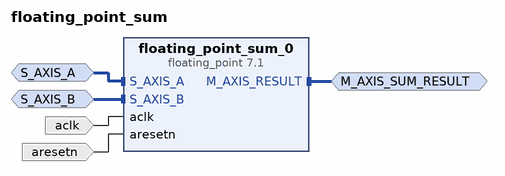
[diagram p0: block diagram of the top level]
# Vivado block design floating_point_sum, xcvu9p-flgb2104-2-i, Vivado 2017.4
create_bd_design floating_point_sum

create_bd_intf_port -mode Master -vlnv xilinx.com:interface:axis_rtl:1.0 M_AXIS_SUM_RESULT
set_property -dict {CONFIG.FREQ_HZ 10000000} [get_bd_intf_ports M_AXIS_SUM_RESULT]
create_bd_intf_port -mode Slave -vlnv xilinx.com:interface:axis_rtl:1.0 S_AXIS_A
set_property -dict [list \
  CONFIG.TDATA_NUM_BYTES 4 \
  CONFIG.TDEST_WIDTH 0 \
  CONFIG.TID_WIDTH 0 \
  CONFIG.TUSER_WIDTH 8 \
  CONFIG.HAS_TREADY 1 \
  CONFIG.HAS_TSTRB 0 \
  CONFIG.HAS_TKEEP 0 \
  CONFIG.HAS_TLAST 0 \
  CONFIG.FREQ_HZ 10000000 \
  CONFIG.LAYERED_METADATA undef \
] [get_bd_intf_ports S_AXIS_A]
create_bd_intf_port -mode Slave -vlnv xilinx.com:interface:axis_rtl:1.0 S_AXIS_B
set_property -dict [list \
  CONFIG.TDATA_NUM_BYTES 4 \
  CONFIG.TDEST_WIDTH 0 \
  CONFIG.TID_WIDTH 0 \
  CONFIG.TUSER_WIDTH 0 \
  CONFIG.HAS_TREADY 1 \
  CONFIG.HAS_TSTRB 0 \
  CONFIG.HAS_TKEEP 0 \
  CONFIG.HAS_TLAST 0 \
  CONFIG.FREQ_HZ 10000000 \
  CONFIG.LAYERED_METADATA undef \
] [get_bd_intf_ports S_AXIS_B]
create_bd_port -dir I -type clk aclk
set_property -dict {CONFIG.FREQ_HZ 10000000} [get_bd_ports aclk]
create_bd_port -dir I -type rst aresetn

create_bd_cell -type ip -vlnv xilinx.com:ip:floating_point:7.1 floating_point_sum_0
set_property -dict [list \
  CONFIG.Add_Sub_Value Add \
  CONFIG.C_Optimization Speed_Optimized \
  CONFIG.C_Mult_Usage Medium_Usage \
  CONFIG.C_Latency 12 \
  CONFIG.C_Rate 1 \
  CONFIG.Has_ARESETn true \
  CONFIG.Has_A_TUSER true \
  CONFIG.A_TUSER_Width 8 \
] [get_bd_cells floating_point_sum_0]

# ---- connections ----

connect_bd_intf_net [get_bd_intf_ports M_AXIS_SUM_RESULT] [get_bd_intf_pins floating_point_sum_0/M_AXIS_RESULT]
connect_bd_intf_net -intf_net S_AXIS_A_0_1 [get_bd_intf_ports S_AXIS_A] [get_bd_intf_pins floating_point_sum_0/S_AXIS_A]
connect_bd_intf_net -intf_net S_AXIS_B_0_1 [get_bd_intf_ports S_AXIS_B] [get_bd_intf_pins floating_point_sum_0/S_AXIS_B]
connect_bd_net -net aclk_0_1 [get_bd_ports aclk] [get_bd_pins floating_point_sum_0/aclk]
connect_bd_net -net aresetn_0_1 [get_bd_ports aresetn] [get_bd_pins floating_point_sum_0/aresetn]

validate_bd_design
save_bd_design
